# EasyEDA Pro project ProProject_ESP32-Gateway_2023-11-01.epro, schematic 8266通过NFC控制继电器
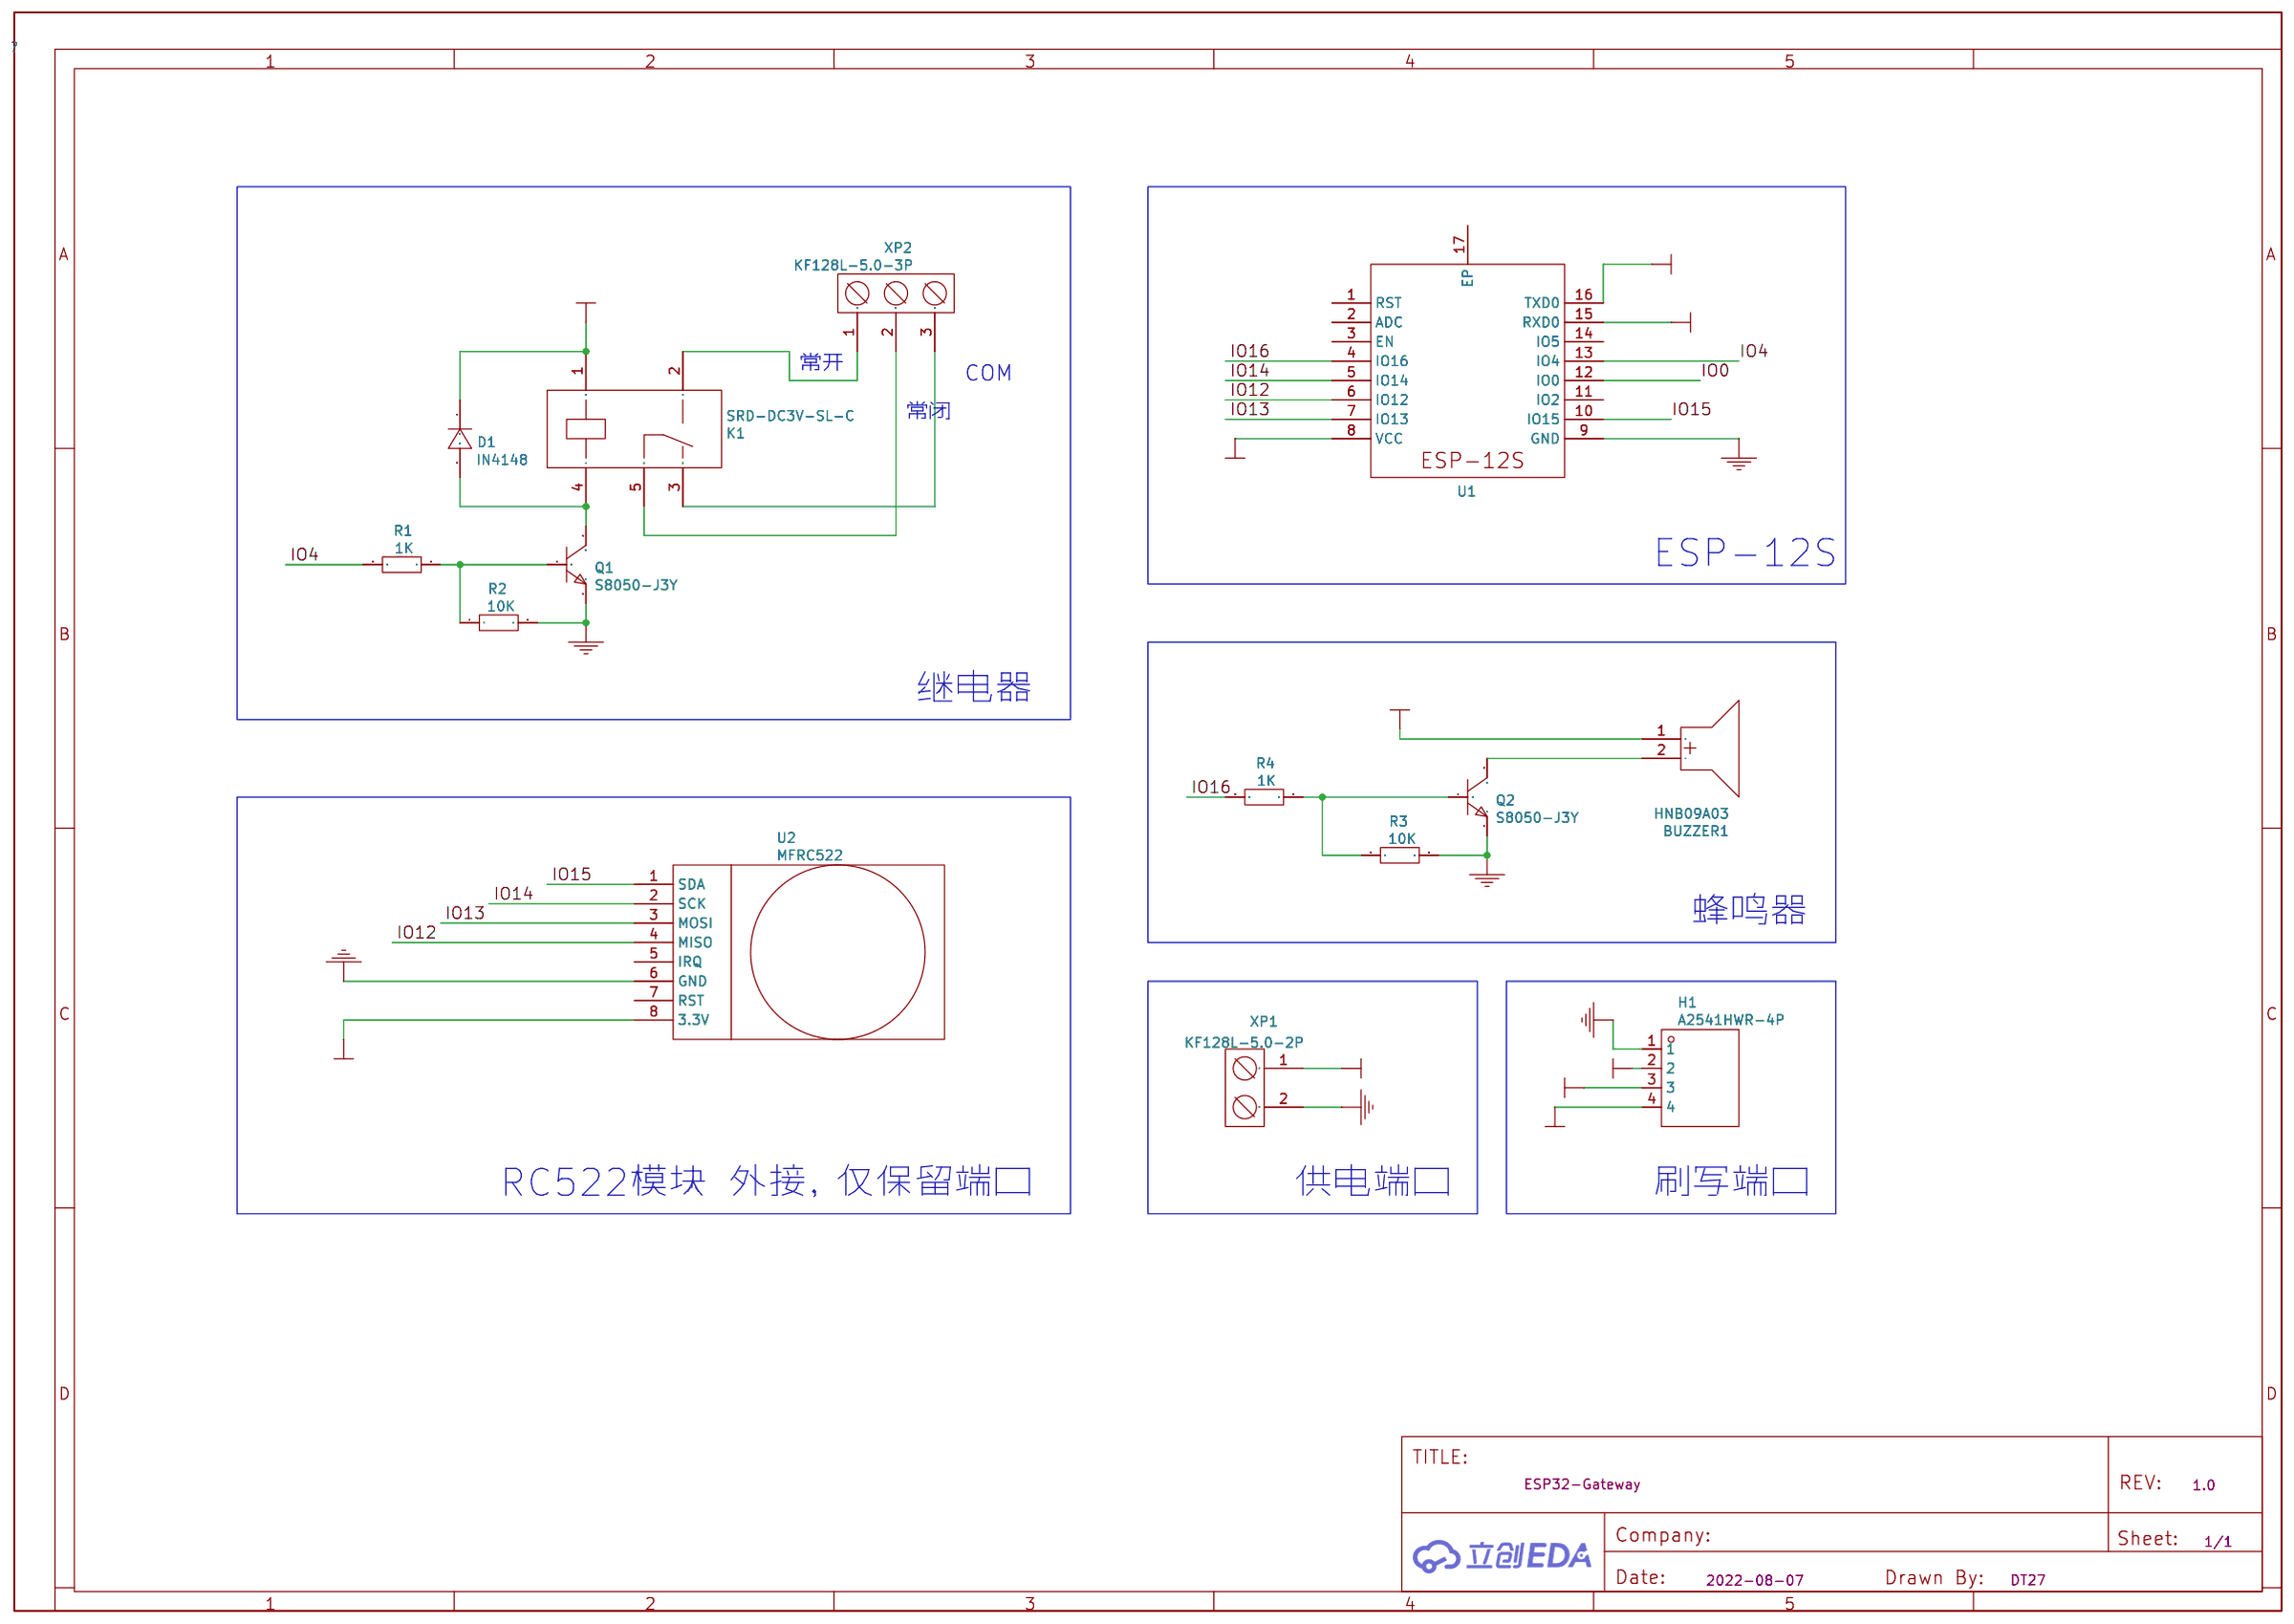
[diagram p0: schematic sheet]

## Parts
BUZZER1  HNB09A03
D1  IN4148
H1  A2541HWR-4P
K1  SRD-DC3V-SL-C
Q1  S8050-J3Y
Q2  S8050-J3Y
R1  1K
R2  10K
R3  10K
R4  1K
U1  ESP-12S
U2  MFRC522
XP1  KF128L-5.0-2P
XP2  KF128L-5.0-3P

## Library data of the parts
BUZZER1 = HNB09A03: Supplier: LCSC; Supplier Part: C96102; Manufacturer: Jiangsu Huaneng Elec; JLCPCB Part Class: Extended Part; Frequency: 3kHz
D1 = IN4148: Supplier: LCSC; Supplier Part: C14538; Manufacturer: Semtech
H1 = A2541HWR-4P: Supplier: LCSC; Supplier Part: C225512; Manufacturer: Changjiang Connectors; JLCPCB Part Class: Extended Part
K1 = SRD-DC3V-SL-C: Supplier: LCSC; Supplier Part: C688864; Manufacturer: Ningbo Songle Relay; JLCPCB Part Class: Extended Part
Q1 Q2 = S8050-J3Y: Supplier: LCSC; Supplier Part: C364312; Manufacturer: (MDD) Jiangsu Yutai Elec
R1 R4 = 1K: Supplier: LCSC; Manufacturer: UniOhm; Manufacturer Part: 0603WAD1001T5E; Supplier Part: C51218; JLCPCB Part Class: Extend
R2 R3 = 10K: Supplier: LCSC; Supplier Part: C167144; Manufacturer: Uniroyal Elec; Manufacturer Part: 0603WAD1002T5E; JLCPCB Part Class: Extend
U1 = ESP-12S: Supplier: LCSC; Manufacturer: Ai-Thinker; Supplier Part: C82898
U2 = MFRC522: Supplier: EasyEDA
XP1 = KF128L-5.0-2P: Manufacturer: KEFA(科发); Supplier: LCSC; Supplier Part: C474938; link: https://atta.szlcsc.com/upload/public/pdf/source/20200115/C474938_80708D3EE0FCBB608268E83D2CCC8A9C.pdf
XP2 = KF128L-5.0-3P: Manufacturer: KEFA(科发); Manufacturer Part: KF128L-5.0-2P; Supplier: LCSC; Supplier Part: C474939; link: https://atta.szlcsc.com/upload/public/pdf/source/20200115/C474938_80708D3EE0FCBB608268E83D2CCC8A9C.pdf

## Nets
+3.3V: BUZZER1.1(+) D1.1 H1.4 K1.1 U1.8(VCC) U2.8(3.3V) XP1.1
GND: H1.1 Q1.2(E) Q2.2(E) R2.2 R3.2 U1.9(GND) U2.6(GND) XP1.2
IO0: U1.12(IO0)
IO4: R1.2 U1.13(IO4)
IO12: U1.6(IO12) U2.4(MISO)
IO13: U1.7(IO13) U2.3(MOSI)
IO14: U1.5(IO14) U2.2(SCK)
IO15: U1.10(IO15) U2.1(SDA)
IO16: R4.2 U1.4(IO16)
RXD: H1.3 U1.15(RXD0)
TXD: H1.2 U1.16(TXD0)
Net-(BUZZER1-2): BUZZER1.2(-) Q2.3(C)
Net-(D1-2): D1.2 K1.4 Q1.3(C)
Net-(K1-2): K1.2 XP2.1
Net-(K1-3): K1.3 XP2.3
Net-(K1-5): K1.5 XP2.2
Net-(Q1-1): Q1.1(B) R1.1 R2.1
Net-(Q2-1): Q2.1(B) R3.1 R4.1

Not connected (* = marked no-connect by the designer): U1 1(RST) 2(ADC) 3(EN) 11(IO2) 14(IO5) 17(EP); U2 5(IRQ) 7(RST)

## Notes on the sheet
- 常开
- COM
- 常闭
- ESP-12S
- 继电器
- 蜂鸣器
- RC522模块 外接，仅保留端口
- 供电端口
- 刷写端口
